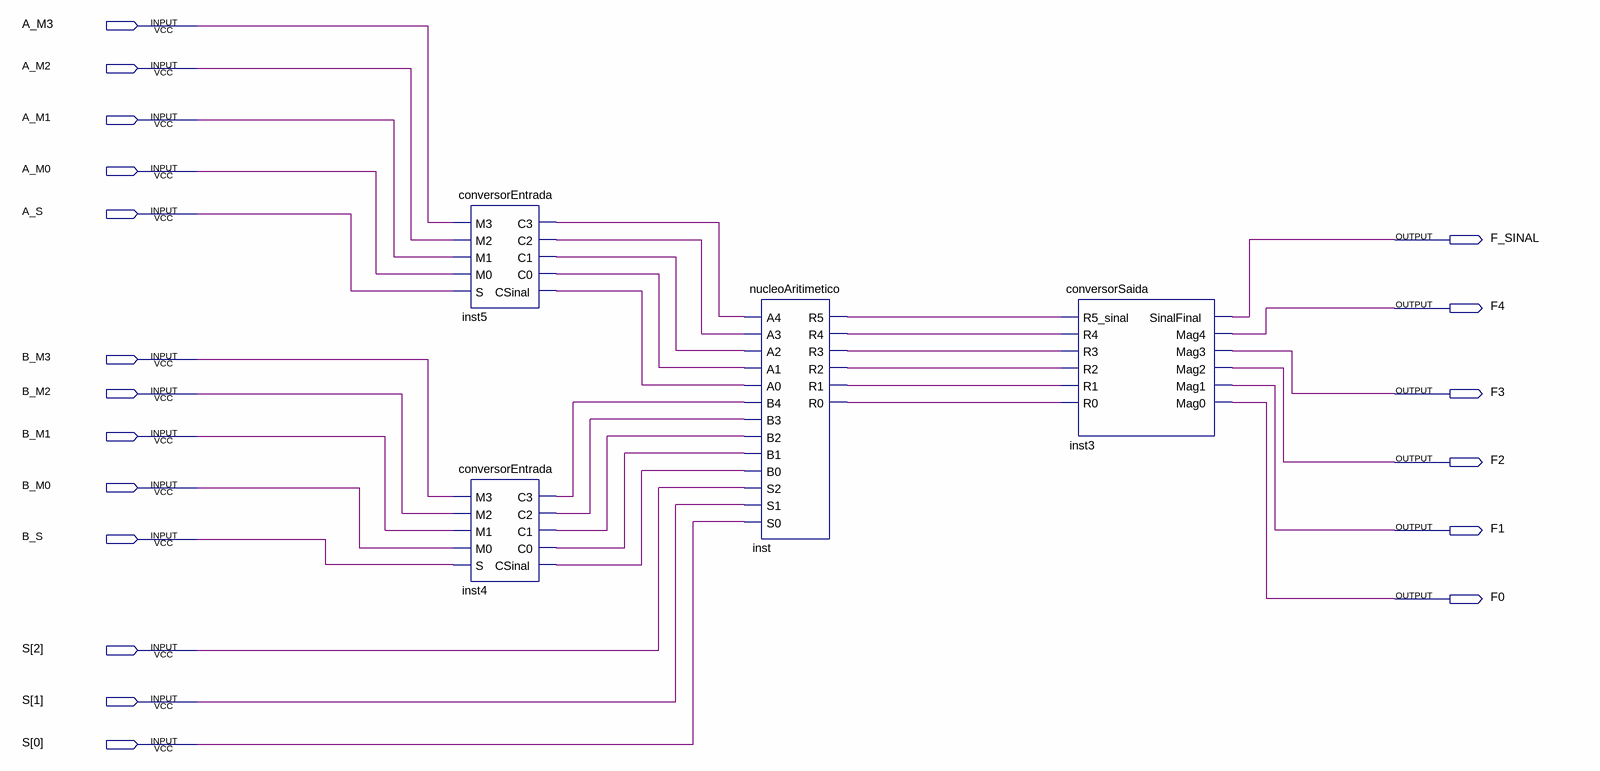
[diagram p0: schematic sheet]
// Quartus schematic UnidadeAritimetica.bdf as structural Verilog: 4 symbols, 19 pins
module UnidadeAritimetica (
  input  A_M3,
  input  A_M2,
  input  A_M1,
  input  A_M0,
  input  A_S,
  input  B_M3,
  input  B_M2,
  input  B_M1,
  input  B_M0,
  input  B_S,
  input  [2:0] S,
  output F_SINAL,
  output F4,
  output F3,
  output F2,
  output F1,
  output F0
);

  wire inst4_c0, inst4_c1, inst4_c2, inst4_c3, inst4_csinal, inst5_c0, inst5_c1, inst5_c2, inst5_c3,
       inst5_csinal, inst_r0, inst_r1, inst_r2, inst_r3, inst_r4, inst_r5;

  conversorEntrada inst5 (
    .M3(A_M3), .M2(A_M2), .M1(A_M1), .M0(A_M0), .S(A_S), .C3(inst5_c3), .C2(inst5_c2), .C1(inst5_c1),
    .C0(inst5_c0), .CSinal(inst5_csinal));
  conversorEntrada inst4 (
    .M3(B_M3), .M2(B_M2), .M1(B_M1), .M0(B_M0), .S(B_S), .C3(inst4_c3), .C2(inst4_c2), .C1(inst4_c1),
    .C0(inst4_c0), .CSinal(inst4_csinal));
  nucleoAritimetico inst (
    .A4(inst5_c3), .A3(inst5_c2), .A2(inst5_c1), .A1(inst5_c0), .A0(inst5_csinal), .B4(inst4_c3),
    .B3(inst4_c2), .B2(inst4_c1), .B1(inst4_c0), .B0(inst4_csinal), .S2(S[2]), .S1(S[1]), .S0(S[0]),
    .R5(inst_r5), .R4(inst_r4), .R3(inst_r3), .R2(inst_r2), .R1(inst_r1), .R0(inst_r0));
  conversorSaida inst3 (
    .R5_sinal(inst_r5), .R4(inst_r4), .R3(inst_r3), .R2(inst_r2), .R1(inst_r1), .R0(inst_r0),
    .SinalFinal(F_SINAL), .Mag4(F4), .Mag3(F3), .Mag2(F2), .Mag1(F1), .Mag0(F0));
endmodule
